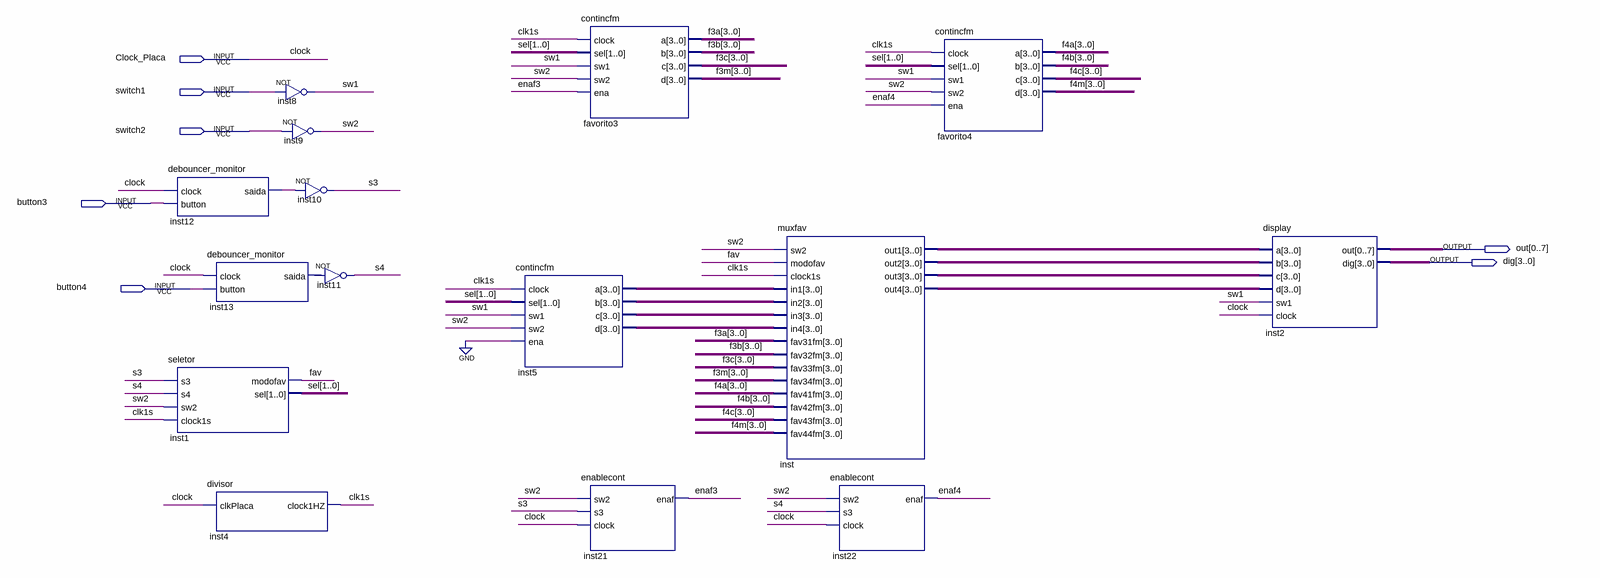
[diagram p0: schematic sheet]
// Quartus schematic testemux.bdf as structural Verilog: 15 symbols, 7 pins
module testemux (
  input  Clock_Placa,
  input  switch1,
  input  switch2,
  input  button3,
  input  button4,
  output [0:7] out,
  output [3:0] dig
);

  wire clk1s, enaf3, enaf4, fav, inst12_saida, inst13_saida, s3, s4, sw1, sw2;
  wire [1:0] sel;
  wire [3:0] f3a, f3b, f3c, f3m, f4a, f4b, f4c, f4m, inst5_a, inst5_b, inst5_c, inst5_d, inst_out1,
       inst_out2, inst_out3, inst_out4;

  debouncer_monitor inst12 (.clock(Clock_Placa), .button(button3), .saida(inst12_saida));
  seletor inst1 (.s3(s3), .s4(s4), .sw2(sw2), .clock1s(clk1s), .modofav(fav), .sel(sel));
  debouncer_monitor inst13 (.clock(Clock_Placa), .button(button4), .saida(inst13_saida));
  divisor inst4 (.clkPlaca(Clock_Placa), .clock1HZ(clk1s));
  not inst8 (sw1, switch1);
  not inst9 (sw2, switch2);
  not inst10 (s3, inst12_saida);
  not inst11 (s4, inst13_saida);
  contincfm inst5 (
    .clock(clk1s), .sel(sel), .sw1(sw1), .sw2(sw2), .ena(1'b0), .a(inst5_a), .b(inst5_b), .c(inst5_c),
    .d(inst5_d));
  contincfm favorito3 (.clock(clk1s), .sel(sel), .sw1(sw1), .sw2(sw2), .ena(enaf3), .a(f3a), .b(f3b), .c(f3c), .d(f3m));
  enablecont inst21 (.sw2(sw2), .s3(s3), .clock(Clock_Placa), .enaf(enaf3));
  muxfav inst (
    .sw2(sw2), .modofav(fav), .clock1s(clk1s), .in1(inst5_a), .in2(inst5_b), .in3(inst5_c), .in4(inst5_d),
    .fav31fm(f3a), .fav32fm(f3b), .fav33fm(f3c), .fav34fm(f3m), .fav41fm(f4a), .fav42fm(f4b), .fav43fm(f4c),
    .fav44fm(f4m), .out1(inst_out1), .out2(inst_out2), .out3(inst_out3), .out4(inst_out4));
  enablecont inst22 (.sw2(sw2), .s3(s4), .clock(Clock_Placa), .enaf(enaf4));
  contincfm favorito4 (.clock(clk1s), .sel(sel), .sw1(sw1), .sw2(sw2), .ena(enaf4), .a(f4a), .b(f4b), .c(f4c), .d(f4m));
  display inst2 (
    .a(inst_out1), .b(inst_out2), .c(inst_out3), .d(inst_out4), .sw1(sw1), .clock(Clock_Placa), .out(out),
    .dig(dig));

  // Other names for the same wires on the sheet: clock = Clock_Placa
endmodule
